# EAGLE design Main (EAGLE 6.0)
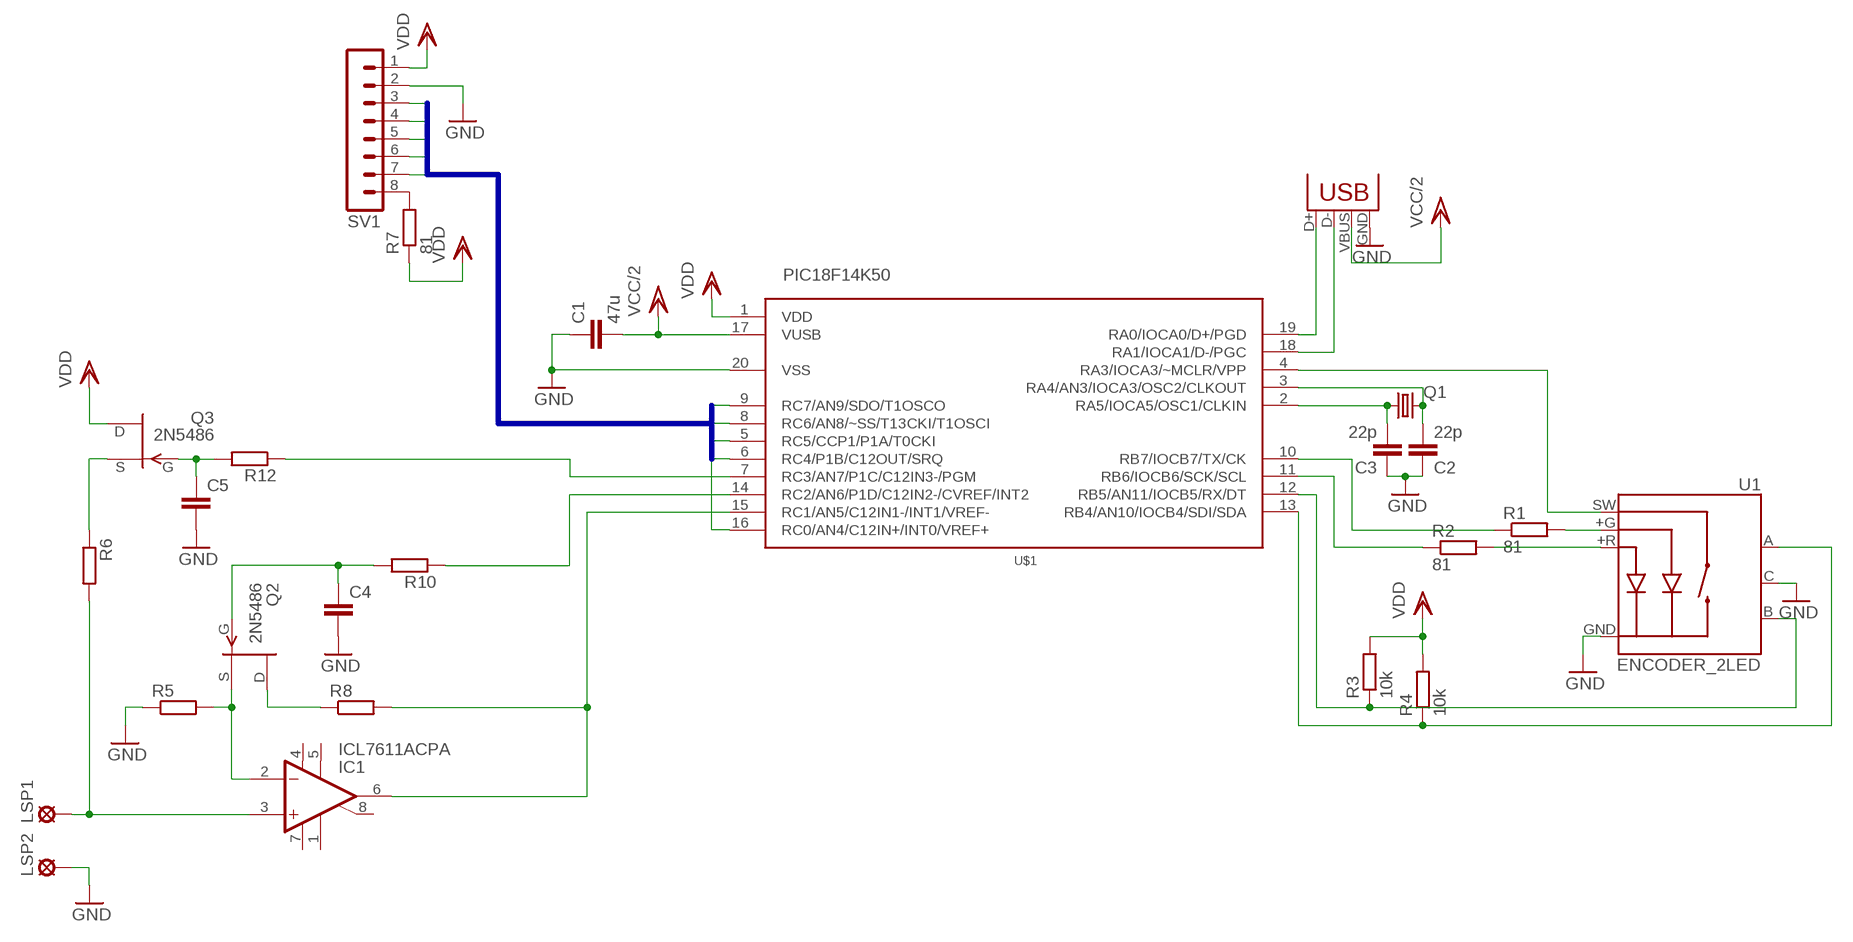
[diagram p0: schematic, sheet 1]

## Parts
C1  47u  C-EU025-025X050  [C025-025X050]
C2  22p  C-EU025-025X050  [C025-025X050]
C3  22p  C-EU025-025X050  [C025-025X050]
C4  C-EU025-025X050  [C025-025X050]
C5  C-EU025-025X050  [C025-025X050]
IC1  ICL7611ACPA  [DIL08]
LSP1  LSP10  [LSP10]
LSP2  LSP10  [LSP10]
Q1  CRYSTALHC49S  [HC49/S]
Q2  2N5486  [TO92-]
Q3  2N5486  [TO92-]
R1  81  R-EU_0207/7  [0207/7]
R2  81  R-EU_0207/7  [0207/7]
R3  10k  R-EU_0207/7  [0207/7]
R4  10k  R-EU_0207/7  [0207/7]
R5  R-EU_0207/7  [0207/7]
R6  R-EU_0207/7  [0207/7]
R7  81  R-EU_0207/7  [0207/7]
R8  R-EU_0207/7  [0207/7]
R10  R-EU_0207/7  [0207/7]
R12  R-EU_0207/7  [0207/7]
SV1  MA08-1  [MA08-1]
U1  ENCODER_2LED  [ENCODER_LED_2]
U$1  PIC18F14K50  [DIP20]
X1  USBPTH  [USB-B-PTH]

## Nets
D/~C: SV1.5 U$1.5(RC5/CCP1/P1A/T0CKI)
GND: C1.1 C2.1 C3.1 C4.2 C5.2 LSP2.MP R5.1 SV1.2 U1.C U1.GND(-) U$1.20(VSS) X1.GND
N$1: C2.2 Q1.2 U$1.3(RA4/AN3/IOCA3/OSC2/CLKOUT)
N$2: U$1.19(RA0/IOCA0/D+/PGD) X1.D+
N$3: U$1.18(RA1/IOCA1/D-/PGC) X1.D-
N$4: C3.2 Q1.1 U$1.2(RA5/IOCA5/OSC1/CLKIN)
N$5: U1.SW U$1.4(RA3/IOCA3/~MCLR/VPP)
N$6: R1.1 U$1.10(RB7/IOCB7/TX/CK)
N$7: R1.2 U1.+G
N$8: Q2.3(D) R8.1
N$9: R2.2 U1.+R
N$10: R2.1 U$1.11(RB6/IOCB6/SCK/SCL)
N$11: R3.1 U1.B U$1.12(RB5/AN11/IOCB5/RX/DT)
N$12: R4.1 U1.A U$1.13(RB4/AN10/IOCB4/SDI/SDA)
N$13: IC1.2(-IN) Q2.2(S) R5.2
N$14: IC1.3(+IN) LSP1.MP R6.2
N$15: R7.2 SV1.8
N$16: IC1.6(OUT) R8.2 U$1.15(RC1/AN5/C12IN1-/INT1/VREF-)
N$17: R10.1 U$1.14(RC2/AN6/P1D/C12IN2-/CVREF/INT2)
N$18: R12.1 U$1.7(RC3/AN7/P1C/C12IN3-/PGM)
N$19: C4.1 Q2.1(G) R10.2
N$20: C5.1 Q3.1(G) R12.2
N$21: Q3.2(S) R6.1
SCLK: SV1.7 U$1.8(RC6/AN8/~SS/T13CKI/T1OSCI)
SDIN: SV1.6 U$1.9(RC7/AN9/SDO/T1OSCO)
VCC/2: C1.2 U$1.17(VUSB) X1.VBUS
VDD: Q3.3(D) R3.2 R4.2 R7.1 SV1.1
VUSB: U$1.1(VDD) ; supply symbol labelled VDD
~RES: SV1.4 U$1.16(RC0/AN4/C12IN+/INT0/VREF+)
~SCE: SV1.3 U$1.6(RC4/P1B/C12OUT/SRQ)
Unconnected: IC1.1(OFF1) IC1.5(OFF2) IC1.8(IOSET)

## Buses
SDIN,SCLK,D/~C,~SCE,~RES

## Power pins joined to a net without a drawn wire
V+: IC1.7(V+)
V-: IC1.4(V-)

## Library data of the parts
C1-C5 = rcl:C-EU: CAPACITOR, European symbol
IC1 = maxim:ICL7611: Single Operational Amplifiers Source: http://datasheets.maxim-ic.com/en/ds/ICL7612-ICL764X.pdf; MPN: ICL7611ACPA+; OC_FARNELL: unknown; OC_NEWARK: 57K8761
LSP1 LSP2 = solpad:LSP10: SOLDER PAD drill 1.0 mm, distributor Buerklin, 12H555
Q1 = crystal:CRYSTAL: CRYSTAL; OC_FARNELL: 1667008; OC_NEWARK: unknown
Q2 Q3 = transistor-fet:?548*: N-Channel JFETs Source: VISHAY 2N5484.pdf Compatible: TO92 2N5245 J304 J305 U310 J308 J309 J310 TO72 2N4416 2N4416A 2N3823 2N4351 3N169 3N170 3N171 MFE3002 TO18 2N3796 2N3797 MFE825 Source: Motorola European Master Guide Pacge 3-59
R1-R8 R10 R12 = rcl:R-EU_: RESISTOR, European symbol
SV1 = con-lstb:MA08-1: PIN HEADER; OC_FARNELL: unknown; OC_NEWARK: unknown
U1 = SparkFun:ENCODER_2LED: Illuminated Rotary Encoder w/ 2 LEDs
U$1 = g5pwlib:PIC18F14K50: PIC 18F14k50 microcontroller
X1 = SparkFun:USB: USB Connectors USB-B-PTH is fully proven SKU : PRT-00139 USB-miniB is fully proven SKU : PRT-00587 USB-A-PCB is untested. USB-A-H is throughly reviewed, but untested. Spark Fun Electronics SKU : PRT-00437 USB-B-SMT is throughly reviewed, but untested. Needs silkscreen touching up. USB-A-S has not been used/tested USB-MB-H has not been used/tested

## Board
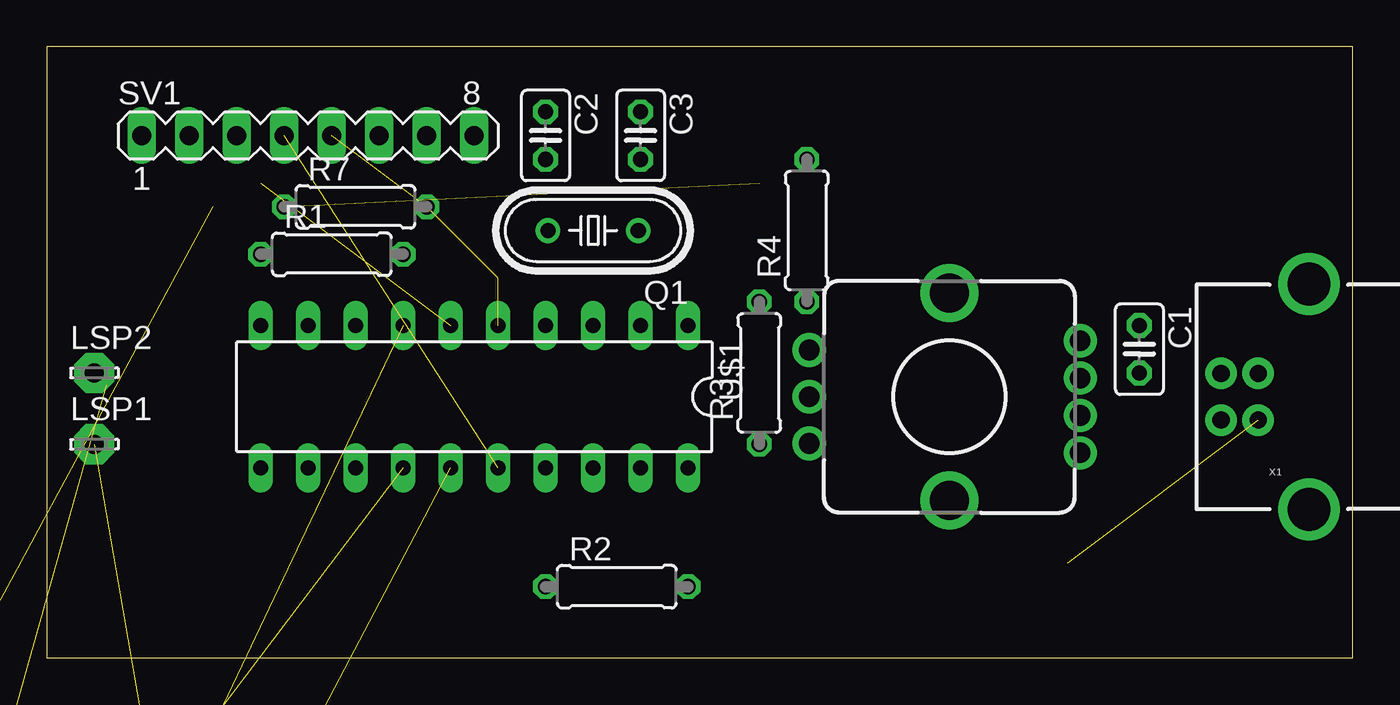
[diagram p1: board, top side]
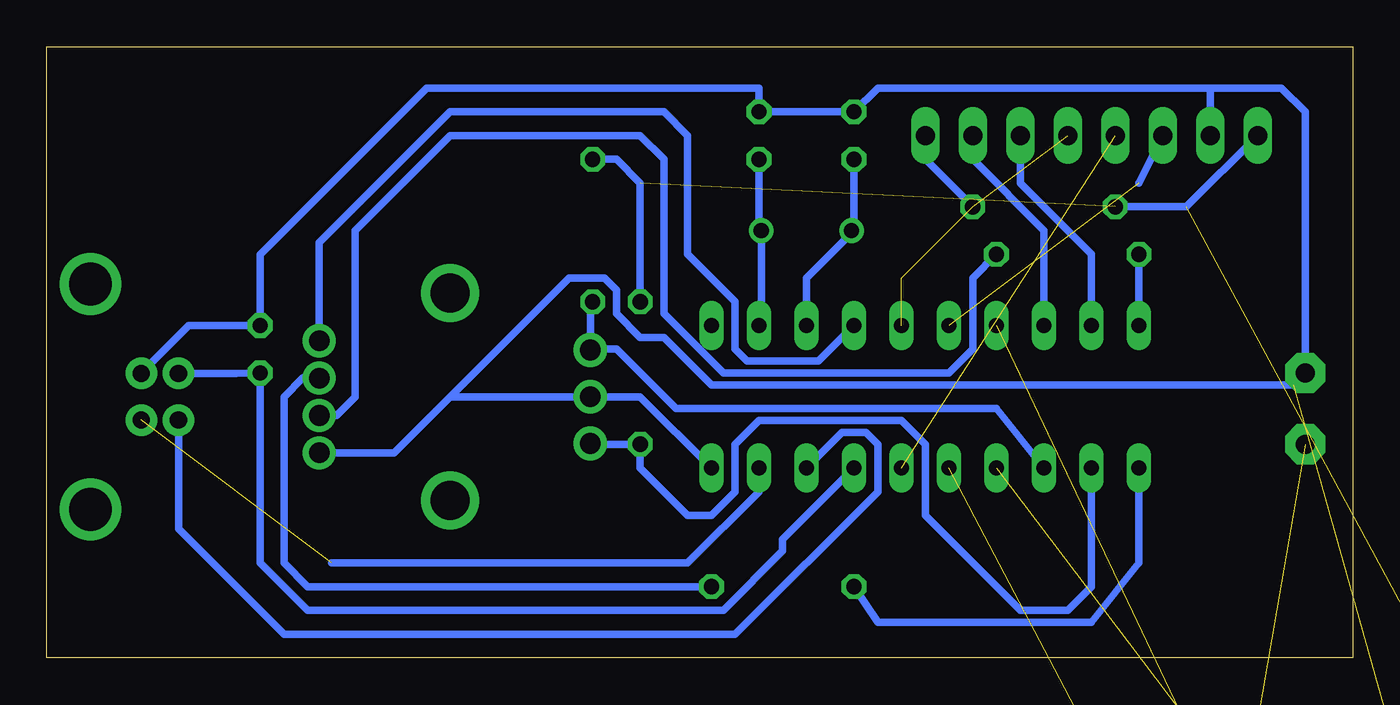
[diagram p2: board, bottom side, seen from below]

Size 69.83 x 32.69 mm. Coordinates in mm from the lower left corner, seen from the top.
Outline: 0,0 69.83,0 69.83,32.69 0,32.69 0,0
Copper layers (1*16): Top 0.035mm / dielectric 1.5mm / Bottom 0.035mm
Design rules: minimum track width 10mil, minimum drill 24mil, track to track 8mil, track to pad 8mil, pad to pad 8mil, via to via 8mil, smd to smd 8mil, copper to edge 40mil, drill to drill 8mil, minimum pad ring 10mil, minimum via ring 8mil, stop-mask expansion 4mil, vias tented up to drill 0mil, thermal gap 10mil

### Footprints (pad centres in the part's own frame; a part is rotated, then mirrored left to right if it is on the bottom)
C025-025X050 = drill 0.813 octagon: 1 -1.27,0; 2 1.27,0
DIL08 = drill 0.813 long: 1 -3.81,-3.81; 2 -1.27,-3.81; 3 1.27,-3.81; 4 3.81,-3.81; 5 3.81,3.81; 6 1.27,3.81; 7 -1.27,3.81; 8 -3.81,3.81
LSP10 = drill 1.016 pad 2.159 octagon: MP 0,0
HC49/S = drill 0.813: 1 -2.413,0; 2 2.413,0
TO92- = drill 0.813 long: 1 2.54,0; 2 0,0; 3 -2.54,0
0207/7 = drill 0.813 octagon: 1 -3.81,0; 2 3.81,0
MA08-1 = drill 1.016 long: 1 -8.89,0; 2 -6.35,0; 3 -3.81,0; 4 -1.27,0; 5 1.27,0; 6 3.81,0; 7 6.35,0; 8 8.89,0
ENCODER_LED_2 = drill 1.1 pad 1.778: +G 1,7; +R -1,7; GND 3,7; SW -3,7 | drill 1.1 pad 1.8: A -2.5,-7.5; B 2.5,-7.5; C 0,-7.5 | drill 2.1: P$1 -5.55,0; P$2 5.55,0
DIP20 = drill 0.813 long: 1 2.54,1.27; 2 5.08,1.27; 3 7.62,1.27; 4 10.16,1.27; 5 12.7,1.27; 6 15.24,1.27; 7 17.78,1.27; 8 20.32,1.27; 9 22.86,1.27; 10 25.4,1.27; 11 25.4,8.89; 12 22.86,8.89; 13 20.32,8.89; 14 17.78,8.89; 15 15.24,8.89; 16 12.7,8.89; 17 10.16,8.89; 18 7.62,8.89; 19 5.08,8.89; 20 2.54,8.89
USB-B-PTH = drill 0.914 pad 1.676: D+ 0,1.25; D- 1.981,1.25; GND 0,-1.25; VBUS 1.981,-1.25 | drill 2.286: S1 -2.718,-6.02; S2 -2.718,6.02

### Placement (x,y rotation side)
C1  58.42,16.51 270 top
C2  26.67,27.94 270 top
C3  31.75,27.94 270 top
C4  -13.97,-41.91 0 top  (outside the outline)
C5  -13.97,-52.07 0 top  (outside the outline)
IC1  7.62,-21.59 0 top  (outside the outline)
LSP1  2.54,11.43 0 top
LSP2  2.54,15.24 0 top
Q1  29.21,22.86 180 top
Q2  -5.08,-22.86 0 top  (outside the outline)
Q3  -13.97,-22.86 0 top  (outside the outline)
R1  15.24,21.59 0 top
R2  30.48,3.81 0 top
R3  38.1,15.24 90 top
R4  40.64,22.86 90 top
R5  -12.7,-62.23 0 top  (outside the outline)
R6  -12.7,-67.31 0 top  (outside the outline)
R7  16.51,24.13 0 top
R8  5.08,-13.97 0 top  (outside the outline)
R10  -12.7,-36.83 0 top  (outside the outline)
R12  -12.7,-57.15 0 top  (outside the outline)
SV1  13.97,27.94 0 top
U1  48.26,13.97 270 top
U$1  36.83,19.05 180 top
X1  64.77,13.97 180 top

### Tracks (layer width: path | path; a pad name or v marks a point on that pad's centre or on a via)
D/~C  (3 unrouted)
GND  (3 unrouted)
  Bottom 0.406: U$1.20 38.1,13.97 U1.C 48.26,13.97 | 7.62,30.48 3.81,30.48 2.54,29.21 LSP2.MP 3.17,14.61 34.29,14.61 36.83,17.14 38.1,17.14 39.37,18.41 39.37,19.68 40.01,20.32 41.91,20.32 48.26,13.97 | 7.62,30.48 25.4,30.48 C2.1 C3.1 31.75,30.48 49.51,30.48 58.42,21.57 C1.1 62.23,17.78 64.77,15.24 X1.GND | U1.GND 51.26,10.97 48.26,13.97 | SV1.2 7.62,30.48
N$1
  Bottom 0.406: U$1.3 29.21,20.32 26.8,22.73 Q1.2 26.67,22.99 C2.2
N$2  (1 unrouted)
  Bottom 0.406: U$1.19 31.75,8.89 35.56,5.08 54.61,5.08
N$3
  Bottom 0.406: U$1.18 27.3,12.06 26.04,12.06 25.4,11.43 25.4,8.89 33.02,1.27 57.15,1.27 62.79,6.91 X1.D-
N$4
  Bottom 0.406: U$1.2 31.62,17.91 Q1.1 31.75,22.99 C3.2
N$5
  Bottom 0.406: U1.SW 55.26,22.21 48.26,29.21 36.83,29.21 35.56,27.94 35.56,21.59 33.02,19.05 33.02,16.51 32.38,15.88 28.57,15.88 U$1.4
N$6
  Bottom 0.406: U$1.10 R1.1
N$7
  Bottom 0.406: U1.+G 54.34,12.97 53.34,13.97 53.34,22.86 48.26,27.94 38.1,27.94 36.83,26.67 36.83,18.41 33.66,15.24 21.59,15.24 20.32,16.51 20.32,20.32 R1.2
N$8  (1 unrouted)
N$9
  Bottom 0.406: R2.2 55.88,3.81 57.15,5.08 57.15,13.97 56.15,14.97 U1.+R
N$10
  Bottom 0.406: U$1.11 11.43,5.08 13.97,1.91 25.4,1.91 R2.1
N$11
  Bottom 0.406: U1.B 40.76,11.43 R3.1 38.1,10.16 35.56,7.62 34.29,7.62 33.02,8.89 33.02,11.43 31.75,12.7 24.13,12.7 22.86,11.43 22.86,7.62 17.78,2.54 15.24,2.54 13.97,3.81 U$1.12
N$12
  Bottom 0.406: R4.1 40.76,19.05 U1.A 40.76,16.51 39.37,16.51 36.2,13.33 19.05,13.33 U$1.13
N$13  (2 unrouted)
N$14  (2 unrouted)
N$15
  Bottom 0.406: R7.2 22.86,26.67 SV1.8
N$16  (2 unrouted)
N$17  (1 unrouted)
N$18  (1 unrouted)
N$19  (2 unrouted)
N$20  (2 unrouted)
N$21  (1 unrouted)
SCLK
  Bottom 0.406: U$1.8 16.51,22.86 20.32,26.67 SV1.7
SDIN
  Bottom 0.406: U$1.9 13.97,21.59 17.78,25.4 SV1.6
VCC/2
  Bottom 0.406: X1.VBUS 59.71,15.22 C1.2 58.42,5.08 55.88,2.54 33.66,2.54 30.48,5.71 30.48,6.35 U$1.17
VDD  (2 unrouted)
  Bottom 0.406: R3.2 38.1,25.4 39.37,26.67 R4.2 | SV1.1 8.89,24.13 R7.1
~RES  (1 unrouted)
~SCE  (1 unrouted)
  Bottom 0.406: SV1.3 11.43,25.4